# Altium schematic sheet Arduino_Mopho_Connectors.SchDoc: Arduino/Morphos extension connectors
size A4; Author: Ph.A; SheetNumber: 5; SheetTotal: 8
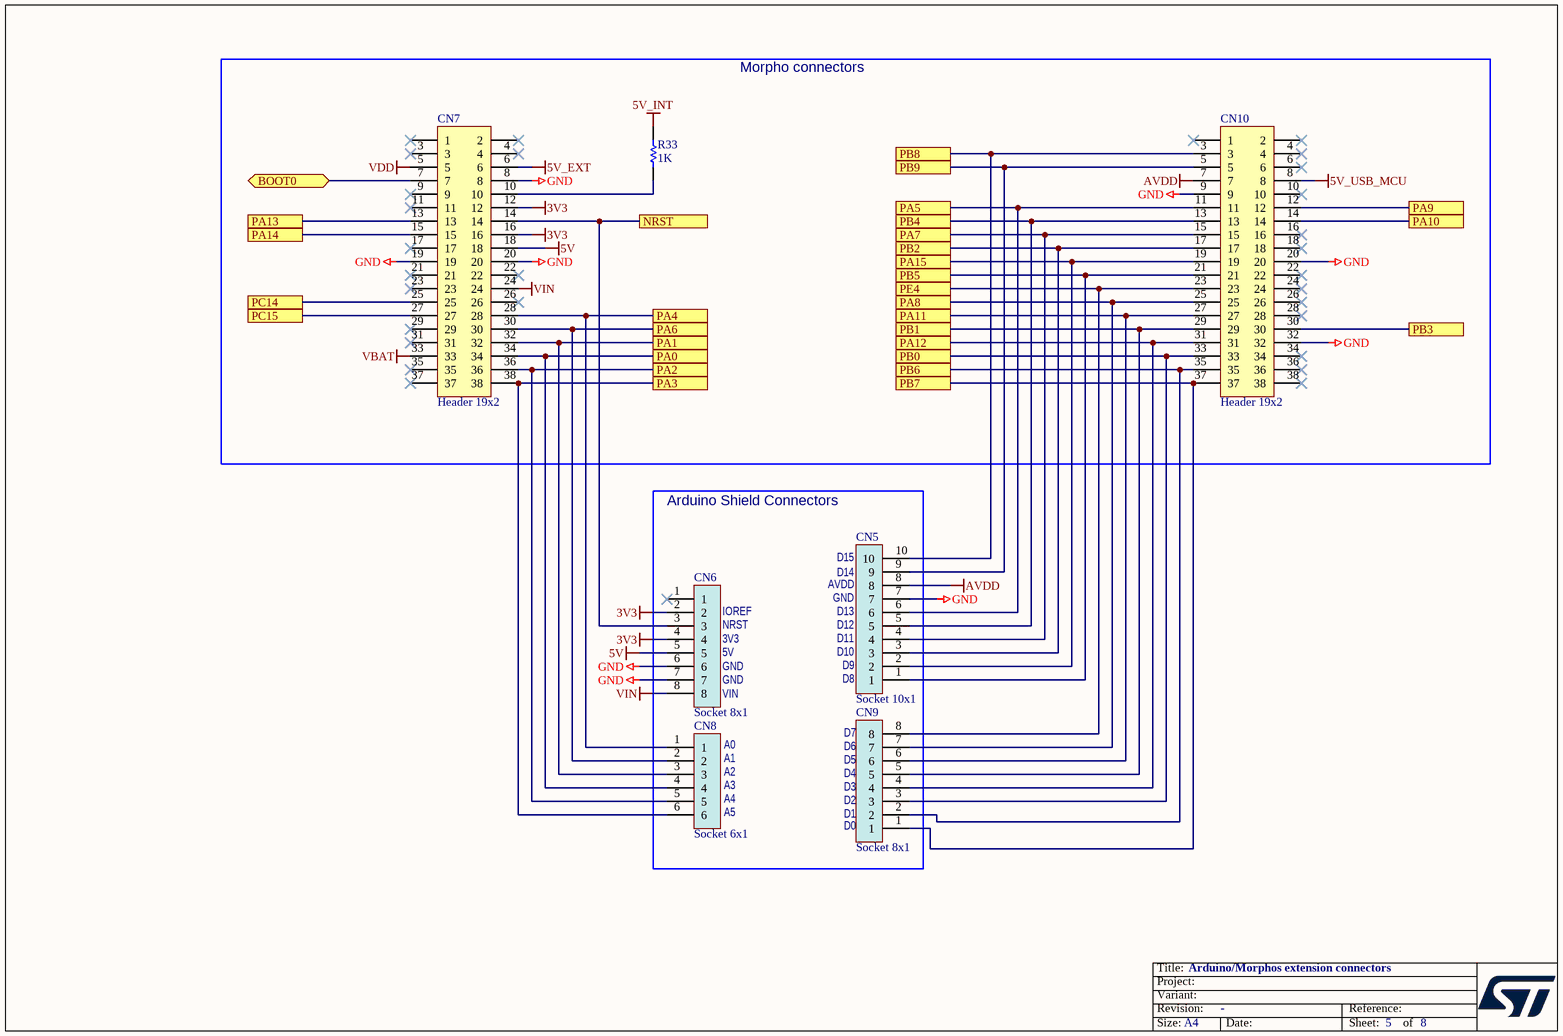
[diagram p0: Arduino_Mopho_Connectors.SchDoc]

## Parts
CN5  Socket 10x1  [CON_SAMTEC_SSW-110-01-X-S]
CN6  Socket 8x1  [CON_SAMTEC_SSW-108-01-X-S]
CN7  Header 19x2  [CON_SAMTEC_TSW-119-09-X-D]
CN8  Socket 6x1  [CON_SAMTEC_SSW-106-01-X-S]
CN9  Socket 8x1  [CON_SAMTEC_SSW-108-01-X-S]
CN10  Header 19x2  [CON_SAMTEC_TSW-119-09-X-D]
R33  value 1K  [R0402]  (hidden comment: Resistor)

## Blocks framed on the sheet
Morpho connectors: CN7 CN10 R33
Arduino Shield Connectors: CN5 CN6 CN8 CN9

## Ports
BOOT0 (bidir), NRST, PA0, PA1, PA2, PA3, PA4, PA5, PA6, PA7, PA8, PA9, PA10, PA11, PA12, PA13, PA14, PA15, PB0, PB1, PB2, PB3, PB4, PB5, PB6, PB7, PB8, PB9, PC14, PC15, PE4

## Nets
3V3: CN6.2 CN6.4 CN7.12 CN7.16
5V: CN6.5 CN7.18
5V_EXT: CN7.6
5V_INT: R33.2
5V_USB_MCU: CN10.8
AVDD: CN5.8 CN10.7
GND: CN5.7 CN6.6 CN6.7 CN7.8 CN7.19 CN7.20 CN10.9 CN10.20 CN10.32
VBAT: CN7.33
VDD: CN7.5
VIN: CN6.8 CN7.24
BOOT0: CN7.7 ; port BOOT0
NRST: CN6.3 CN7.14 ; port NRST
PA0: CN7.34 CN8.4 ; port PA0
PA1: CN7.32 CN8.3 ; port PA1
PA2: CN7.36 CN8.5 ; port PA2
PA3: CN7.38 CN8.6 ; port PA3
PA4: CN7.28 CN8.1 ; port PA4
PA5: CN5.6 CN10.11 ; port PA5
PA6: CN7.30 CN8.2 ; port PA6
PA7: CN5.4 CN10.15 ; port PA7
PA8: CN9.7 CN10.25 ; port PA8
PA9: CN10.12 ; port PA9
PA10: CN10.14 ; port PA10
PA11: CN9.6 CN10.27 ; port PA11
PA12: CN9.4 CN10.31 ; port PA12
PA13: CN7.13 ; port PA13
PA14: CN7.15 ; port PA14
PA15: CN5.2 CN10.19 ; port PA15
PB0: CN9.3 CN10.33 ; port PB0
PB1: CN9.5 CN10.29 ; port PB1
PB2: CN5.3 CN10.17 ; port PB2
PB3: CN10.30 ; port PB3
PB4: CN5.5 CN10.13 ; port PB4
PB5: CN5.1 CN10.21 ; port PB5
PB6: CN9.2 CN10.35 ; port PB6
PB7: CN9.1 CN10.37 ; port PB7
PB8: CN5.10 CN10.3 ; port PB8
PB9: CN5.9 CN10.5 ; port PB9
PC14: CN7.25 ; port PC14
PC15: CN7.27 ; port PC15
PE4: CN9.8 CN10.23 ; port PE4
NetCN7_10: CN7.10 R33.1

Not connected (* = marked no-connect by the designer): CN6 1*; CN7 1* 2* 3* 4* 9* 11* 17* 21* 22* 23* 26* 29* 31* 35* 37*; CN10 1* 2* 4* 6* 10* 16* 18* 22* 24* 26* 28* 34* 36* 38*

## Notes on the sheet
- (near CN5) D14
- (near CN5) D15
- (near CN6) 3V3
- (near CN6) NRST
- (near CN6) IOREF
- (near CN5) AVDD
- (near CN5) GND
- (near CN5) D10
- (near CN5) D11
- (near CN5) D12
- (near CN5) D13
- (near CN6) GND
- (near CN6) VIN
- (near CN6) 5V
- (near CN5) D9
- (near CN5) D8
- (near CN8) A0
- (near CN8) A1
- (near CN8) A2
- (near CN8) A3
- (near CN9) D3
- (near CN9) D4
- (near CN9) D5
- (near CN9) D6
- (near CN9) D7
- (near CN8) A5
- (near CN8) A4
- (near CN9) D0
- (near CN9) D1
- (near CN9) D2
- Title:
- Project:
- Size:
- Revision:
- Variant:
- -
- Date:
- Reference:
- Sheet:
- of

## Library data of the parts
CN5 = MCD-02080: Socket 10x1, 2.54mm, VR, TH, height 8.51/2.64mm; Part_Type: Connector; Manufacturer_Part_Number: SSW-110-01-G-S; Manufacturer: SAMTEC; Alternate_Manufacturer_Part_Number: 218110S16198; Alternate_Manufacturer: JIUBABA; Part_Preference: Recommended; Order_Code_RS: 765-5736; Internal_Part_Number: MCD-02080; Status: Checked; ComponentLink1URL: http://tunmcdsvn.tun.st.com/Component_Datasheet_Library/Trunk/Connectors/Samtec_SSW-SSQ-series/Samtec_SSW-SSQ-series.pdf; Value: Socket 10x1; Package: N/A; Order_Code_Digikey: SSW-110-01-G-S-LL-ND; Order_Code_Farnell: 1668374
CN6 CN9 = MCD-01743: Socket 8x1, 2.54mm, VR, TH, height 8.51/2.64mm; Part_Type: Connector; Manufacturer_Part_Number: SSW-108-01-G-S; Manufacturer: SAMTEC; Alternate_Manufacturer_Part_Number: 988.08.18.2.00050 (218108S16198); Alternate_Manufacturer: Jiubaba; Part_Preference: Recommended; Internal_Part_Number: MCD-01743; Value: Socket 8x1; Status: Released; ComponentLink1URL: http://tunmcdsvn.tun.st.com/Component_Datasheet_Library/Trunk/Connectors/Samtec_SSW-SSQ-series/Samtec_SSW-SSQ-series.pdf
CN7 CN10 = MCD-00213: Header, 19x2, 2,54mm, VR, TH, Height 5.84mm/10.16mm; Part_Type: Connector; Manufacturer_Part_Number: TSW-119-09-G-D; Manufacturer: SAMTEC; Part_Preference: Recommended; Internal_Part_Number: MCD-00213; Value: Header 19x2; Status: Released; ComponentLink1URL: http://tunmcdsvn.tun.st.com/Component_Datasheet_Library/Trunk/Connectors/Samtec_TSW-HTSW-series
CN8 = MCD-02079: Socket 6x1, 2.54mm, VR, TH, height 8.51/2.64mm; Part_Type: Connector; Manufacturer_Part_Number: SSW-106-01-G-S; Manufacturer: SAMTEC; Alternate_Manufacturer_Part_Number: 218106S16198; Alternate_Manufacturer: JIUBABA; Part_Preference: Recommended; Order_Code_RS: 765-5666; Internal_Part_Number: MCD-02079; Status: Checked; ComponentLink1URL: http://tunmcdsvn.tun.st.com/Component_Datasheet_Library/Trunk/Connectors/Samtec_SSW-SSQ-series/Samtec_SSW-SSQ-series.pdf; Value: Socket 6x1; Package: N/A; Order_Code_Digikey: SSW-106-01-G-S-LL-ND; Order_Code_Farnell: 1668352
R33 = MCD-00061: Resistor,1K,0402,1%,1/16W; Manufacturer_Part_Number: RC0402FR-071KL; Manufacturer: YAGEO; Part_Preference: Recommended; Internal_Part_Number: MCD-00061; Status: Released; Part_Type: Resistor; Package: R0402; ComponentLink1URL: http://tunmcdsvn.tun.st.com/Component_Datasheet_Library/Trunk/Resistors/Yageo_Resistor_RC0402-series; Order_Code_Digikey: 311-1.00KLRCT-ND; Order_Code_Farnell: 9239235; Order_Code_RS: N/A